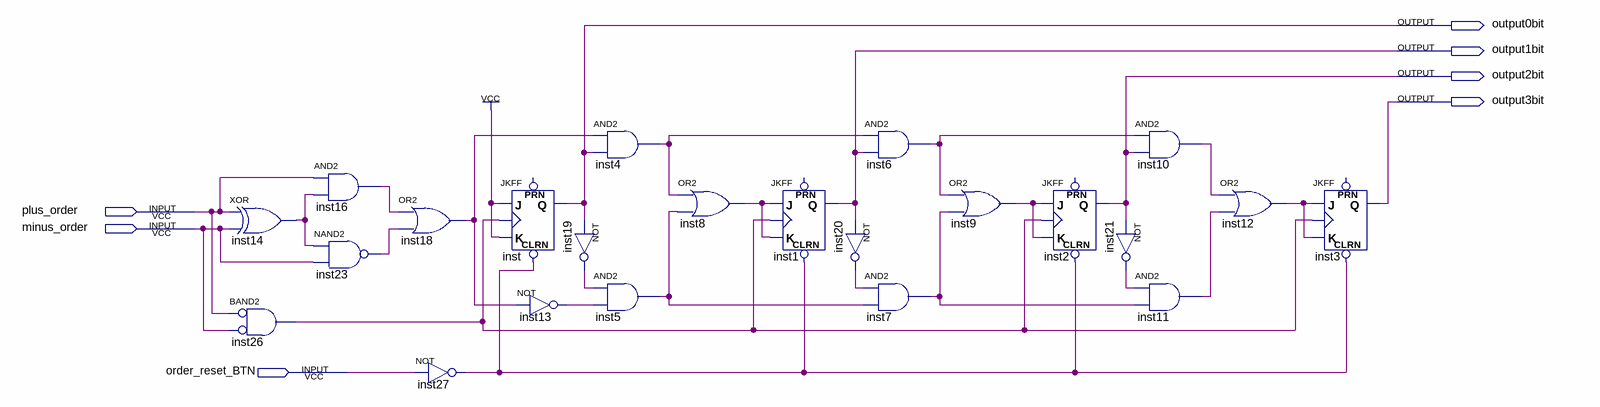
[diagram p0: schematic sheet]
// Quartus schematic up_down_counter.bdf as structural Verilog: 23 symbols, 7 pins
module up_down_counter (
  input  plus_order,
  input  minus_order,
  input  order_reset_BTN,
  output output0bit,
  output output1bit,
  output output2bit,
  output output3bit
);

  wire inst4_out, inst5_out, inst6_out, inst7_out, inst8_out, inst9_out, inst10_out, inst11_out, inst12_out,
       inst13_out, inst14_out, inst16_out, inst18_out, inst19_out, inst20_out, inst21_out, inst23_out,
       inst26_out, inst27_out;

  xor inst14 (inst14_out, plus_order, minus_order);
  and inst26 (inst26_out, ~plus_order, ~minus_order);  // BAND2
  and inst16 (inst16_out, plus_order, inst14_out);
  nand inst23 (inst23_out, inst14_out, minus_order);
  or inst18 (inst18_out, inst16_out, inst23_out);
  not inst27 (inst27_out, order_reset_BTN);
  JKFF inst (.CLRN(inst27_out), .K(1'b1), .J(1'b1), .CLK(inst26_out), .Q(output0bit));  // open: PRN
  not inst13 (inst13_out, inst18_out);
  and inst4 (inst4_out, inst18_out, output0bit);
  not inst19 (inst19_out, output0bit);
  and inst5 (inst5_out, inst19_out, inst13_out);
  or inst8 (inst8_out, inst4_out, inst5_out);
  JKFF inst1 (.CLRN(inst27_out), .K(inst8_out), .J(inst8_out), .CLK(inst26_out), .Q(output1bit));  // open: PRN
  and inst6 (inst6_out, inst4_out, output1bit);
  not inst20 (inst20_out, output1bit);
  and inst7 (inst7_out, inst20_out, inst5_out);
  or inst9 (inst9_out, inst6_out, inst7_out);
  JKFF inst2 (.CLRN(inst27_out), .K(inst9_out), .J(inst9_out), .CLK(inst26_out), .Q(output2bit));  // open: PRN
  and inst10 (inst10_out, inst6_out, output2bit);
  not inst21 (inst21_out, output2bit);
  and inst11 (inst11_out, inst21_out, inst7_out);
  or inst12 (inst12_out, inst10_out, inst11_out);
  JKFF inst3 (.CLRN(inst27_out), .K(inst12_out), .J(inst12_out), .CLK(inst26_out), .Q(output3bit));  // open: PRN
endmodule
